# Altium schematic sheet E16-PDB-1-MASTER.SchDoc
size A
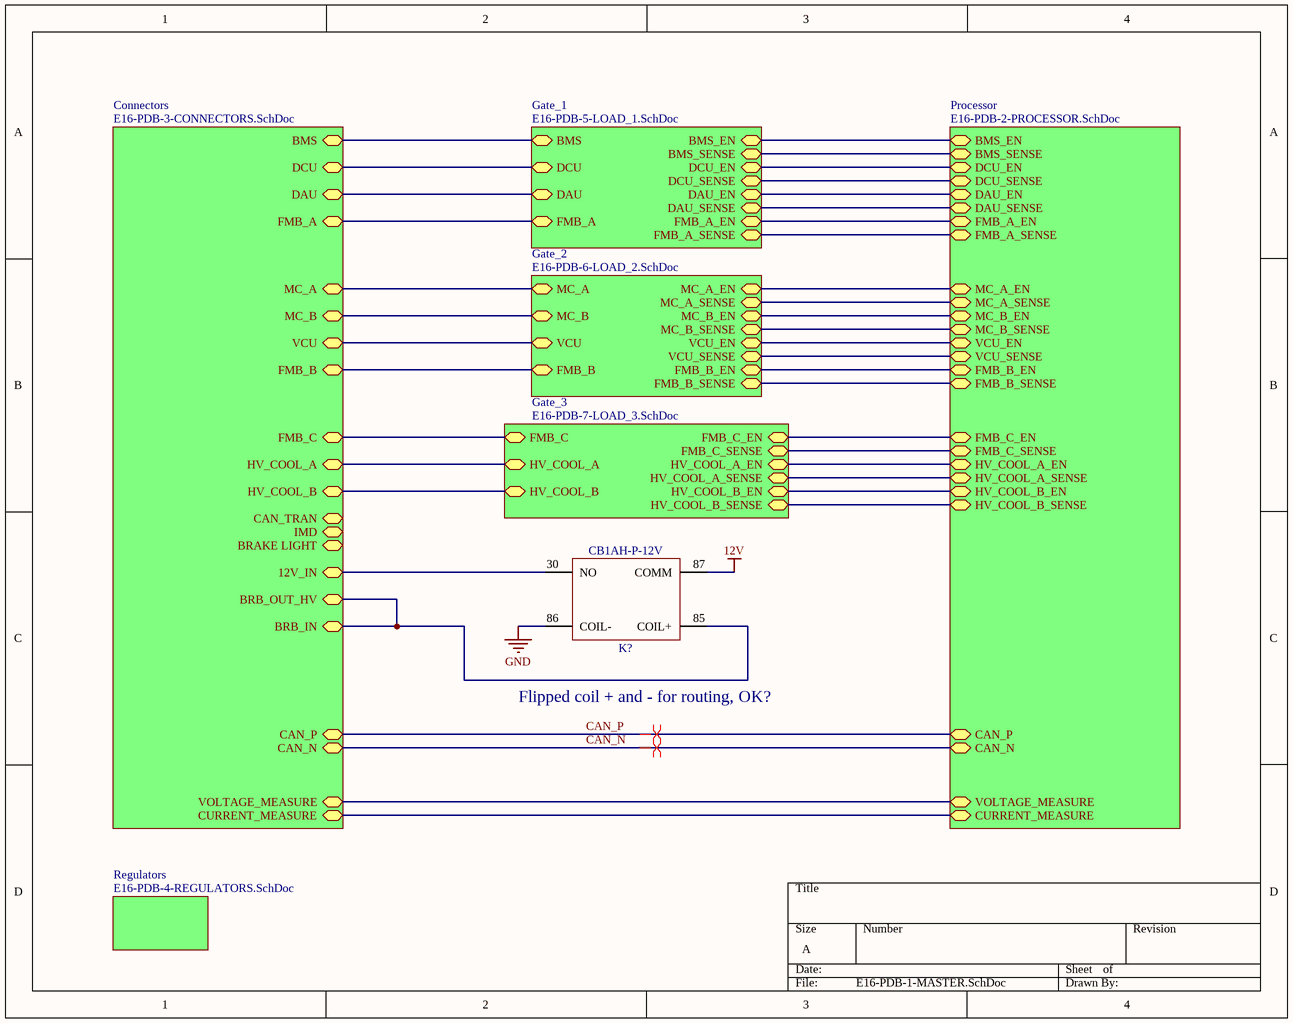
[diagram p0: E16-PDB-1-MASTER.SchDoc]

## Parts
K?  CB1AH-P-12V  [CB1AH-P-12V]

## Sub-sheets
Connectors = E16-PDB-3-CONNECTORS.SchDoc: BMS, DCU, DAU, MC_A, MC_B, FMB_A, FMB_B, FMB_C, BRB_IN, IMD, BRAKE LIGHT, CAN_P, CAN_N, VOLTAGE_MEASURE, CURRENT_MEASURE, HV_COOL_A, HV_COOL_B, BRB_OUT_HV, 12V_IN, VCU, CAN_TRAN
Gate_1 = E16-PDB-5-LOAD_1.SchDoc: BMS, DCU, DAU, BMS_EN, DCU_EN, DAU_EN, BMS_SENSE, DCU_SENSE, DAU_SENSE, FMB_A, FMB_A_EN, FMB_A_SENSE
Gate_2 = E16-PDB-6-LOAD_2.SchDoc: MC_A, MC_B, MC_A_EN, MC_B_EN, MC_A_SENSE, MC_B_SENSE, FMB_B, FMB_B_EN, FMB_B_SENSE, VCU, VCU_EN, VCU_SENSE
Gate_3 = E16-PDB-7-LOAD_3.SchDoc: FMB_C, FMB_C_EN, FMB_C_SENSE, HV_COOL_A_SENSE, HV_COOL_A_EN, HV_COOL_B_SENSE, HV_COOL_B_EN, HV_COOL_A, HV_COOL_B
Processor = E16-PDB-2-PROCESSOR.SchDoc: BMS_EN, DCU_EN, DAU_EN, VCU_EN, MC_A_EN, MC_B_EN, FMB_A_EN, FMB_B_EN, FMB_C_EN, VOLTAGE_MEASURE, CURRENT_MEASURE, CAN_P, CAN_N, BMS_SENSE, DCU_SENSE, DAU_SENSE, VCU_SENSE, MC_A_SENSE, MC_B_SENSE, FMB_A_SENSE, FMB_B_SENSE, FMB_C_SENSE, HV_COOL_A_SENSE, HV_COOL_A_EN, HV_COOL_B_SENSE, HV_COOL_B_EN
Regulators = E16-PDB-4-REGULATORS.SchDoc: no entries

## Nets
12V: K?.87(COMM)
GND: K?.86(COIL-)
CAN_N: sheet Connectors/CAN_N, sheet Processor/CAN_N
CAN_P: sheet Connectors/CAN_P, sheet Processor/CAN_P
NetK?_30: K?.30(NO) ; sheet Connectors/12V_IN
NetK?_85: K?.85(COIL+) ; sheet Connectors/BRB_IN, sheet Connectors/BRB_OUT_HV
(unnamed): sheet Connectors/BMS, sheet Gate_1/BMS
(unnamed): sheet Connectors/DCU, sheet Gate_1/DCU
(unnamed): sheet Connectors/DAU, sheet Gate_1/DAU
(unnamed): sheet Connectors/MC_A, sheet Gate_2/MC_A
(unnamed): sheet Connectors/MC_B, sheet Gate_2/MC_B
(unnamed): sheet Connectors/FMB_A, sheet Gate_1/FMB_A
(unnamed): sheet Connectors/FMB_B, sheet Gate_2/FMB_B
(unnamed): sheet Connectors/FMB_C, sheet Gate_3/FMB_C
(unnamed): sheet Connectors/VOLTAGE_MEASURE, sheet Processor/VOLTAGE_MEASURE
(unnamed): sheet Connectors/CURRENT_MEASURE, sheet Processor/CURRENT_MEASURE
(unnamed): sheet Connectors/HV_COOL_A, sheet Gate_3/HV_COOL_A
(unnamed): sheet Connectors/HV_COOL_B, sheet Gate_3/HV_COOL_B
(unnamed): sheet Connectors/VCU, sheet Gate_2/VCU
(unnamed): sheet Processor/BMS_EN, sheet Gate_1/BMS_EN
(unnamed): sheet Processor/DCU_EN, sheet Gate_1/DCU_EN
(unnamed): sheet Processor/DAU_EN, sheet Gate_1/DAU_EN
(unnamed): sheet Processor/VCU_EN, sheet Gate_2/VCU_EN
(unnamed): sheet Processor/MC_A_EN, sheet Gate_2/MC_A_EN
(unnamed): sheet Processor/MC_B_EN, sheet Gate_2/MC_B_EN
(unnamed): sheet Processor/FMB_A_EN, sheet Gate_1/FMB_A_EN
(unnamed): sheet Processor/FMB_B_EN, sheet Gate_2/FMB_B_EN
(unnamed): sheet Processor/FMB_C_EN, sheet Gate_3/FMB_C_EN
(unnamed): sheet Processor/BMS_SENSE, sheet Gate_1/BMS_SENSE
(unnamed): sheet Processor/DCU_SENSE, sheet Gate_1/DCU_SENSE
(unnamed): sheet Processor/DAU_SENSE, sheet Gate_1/DAU_SENSE
(unnamed): sheet Processor/VCU_SENSE, sheet Gate_2/VCU_SENSE
(unnamed): sheet Processor/MC_A_SENSE, sheet Gate_2/MC_A_SENSE
(unnamed): sheet Processor/MC_B_SENSE, sheet Gate_2/MC_B_SENSE
(unnamed): sheet Processor/FMB_A_SENSE, sheet Gate_1/FMB_A_SENSE
(unnamed): sheet Processor/FMB_B_SENSE, sheet Gate_2/FMB_B_SENSE
(unnamed): sheet Processor/FMB_C_SENSE, sheet Gate_3/FMB_C_SENSE
(unnamed): sheet Processor/HV_COOL_A_SENSE, sheet Gate_3/HV_COOL_A_SENSE
(unnamed): sheet Processor/HV_COOL_A_EN, sheet Gate_3/HV_COOL_A_EN
(unnamed): sheet Processor/HV_COOL_B_SENSE, sheet Gate_3/HV_COOL_B_SENSE
(unnamed): sheet Processor/HV_COOL_B_EN, sheet Gate_3/HV_COOL_B_EN

## Layout directives
differential pair: CAN_N, CAN_P

## Notes on the sheet
- Flipped coil + and - for routing, OK?

## Library data of the parts
K? = CB1AH-P-12V: Relay 12V 70A SPST; MFG: Panasonic Electric Works; Supplier 1: Digi-Key; Supplier Part Number 1: 255-2177-ND; MFG_PN: CB1AH-P-12V